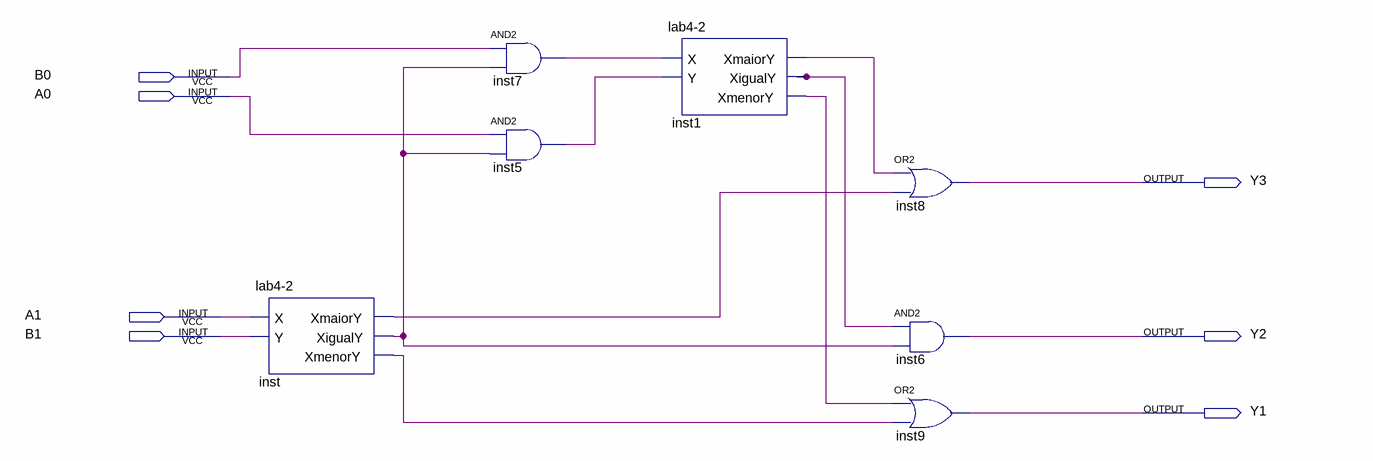
[diagram p0: schematic sheet]
// Quartus schematic lab4-3.bdf as structural Verilog: 7 symbols, 7 pins
module \lab4-3  (
  input  B0,
  input  A0,
  input  A1,
  input  B1,
  output Y3,
  output Y2,
  output Y1
);

  wire inst1_xigualy, inst1_xmaiory, inst1_xmenory, inst5_out, inst7_out, inst_xigualy, inst_xmaiory,
       inst_xmenory;

  \lab4-2  inst (.X(A1), .Y(B1), .XmaiorY(inst_xmaiory), .XigualY(inst_xigualy), .XmenorY(inst_xmenory));
  and inst7 (inst7_out, B0, inst_xigualy);
  and inst5 (inst5_out, A0, inst_xigualy);
  \lab4-2  inst1 (
    .X(inst7_out), .Y(inst5_out), .XmaiorY(inst1_xmaiory), .XigualY(inst1_xigualy), .XmenorY(inst1_xmenory));
  or inst8 (Y3, inst1_xmaiory, inst_xmaiory);
  and inst6 (Y2, inst1_xigualy, inst_xigualy);
  or inst9 (Y1, inst1_xmenory, inst_xmenory);
endmodule
